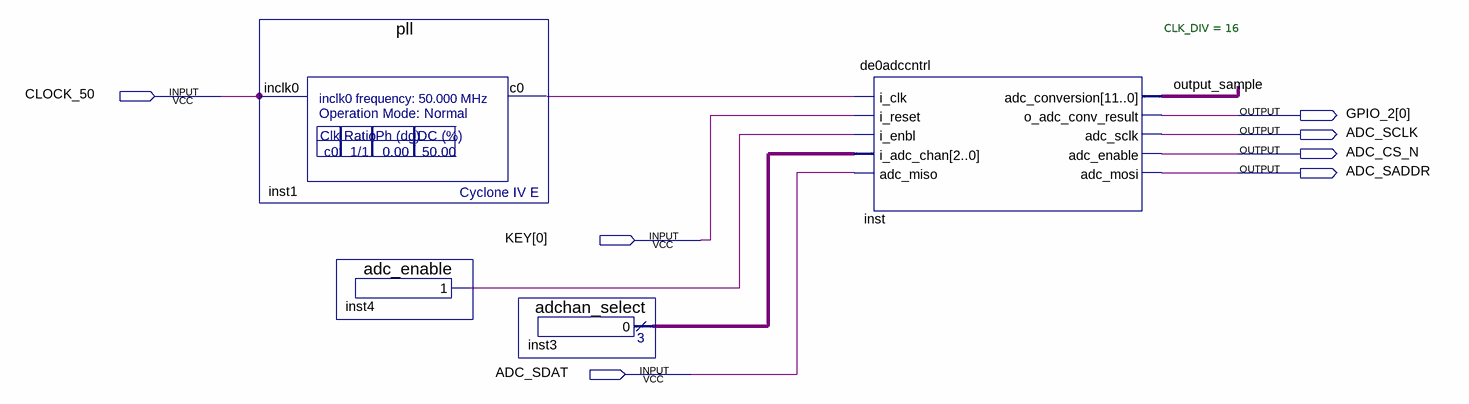
[diagram p0: schematic sheet]
// Quartus schematic DE0ADCV1.bdf as structural Verilog: 4 symbols, 7 pins
module DE0ADCV1 (
  input  CLOCK_50,
  input  [0:0] KEY,
  input  ADC_SDAT,
  output [0:0] GPIO_2,
  output ADC_SCLK,
  output ADC_CS_N,
  output ADC_SADDR
);

  wire inst1_c0, inst4_result, output_sample;
  wire [2:0] inst3_result;

  pll inst1 (.inclk0(CLOCK_50), .c0(inst1_c0));
  adc_enable inst4 (.result(inst4_result));
  adchan_select inst3 (.result(inst3_result));
  de0adccntrl #(.CLK_DIV(16)) inst (
    .i_clk(inst1_c0), .i_reset(KEY[0]), .i_enbl(inst4_result), .i_adc_chan(inst3_result),
    .adc_miso(ADC_SDAT), .adc_conversion(output_sample), .o_adc_conv_result(GPIO_2[0]), .adc_sclk(ADC_SCLK),
    .adc_enable(ADC_CS_N), .adc_mosi(ADC_SADDR));
endmodule
